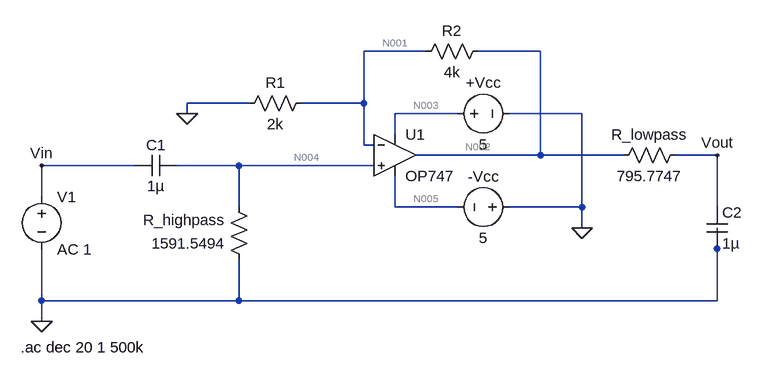
[diagram p0: schematic RC_Active Bandpass Filter.asc]
RC_Active Bandpass Filter.asc, the LTspice schematic file:
Version 4
SHEET 1 968 680
WIRE 432 -64 336 -64
WIRE 608 -64 512 -64
WIRE 160 16 64 16
WIRE 336 16 336 -64
WIRE 336 16 240 16
WIRE 64 32 64 16
WIRE 480 32 384 32
WIRE 672 32 560 32
WIRE 384 64 384 32
WIRE 336 80 336 16
WIRE 352 80 336 80
WIRE 608 96 608 -64
WIRE 608 96 416 96
WIRE 736 96 608 96
WIRE 880 96 816 96
WIRE -16 112 -160 112
WIRE 144 112 48 112
WIRE 352 112 144 112
WIRE -160 160 -160 112
WIRE 144 176 144 112
WIRE 384 176 384 128
WIRE 480 176 384 176
WIRE 672 176 672 32
WIRE 672 176 560 176
WIRE 880 176 880 96
WIRE 672 208 672 176
WIRE 880 240 880 208
WIRE -160 320 -160 240
WIRE 144 320 144 256
WIRE 144 320 -160 320
WIRE 880 320 880 240
WIRE 880 320 144 320
WIRE -160 352 -160 320
FLAG 64 32 0
FLAG -160 352 0
FLAG -160 112 Vin
FLAG 880 96 Vout
FLAG 672 208 0
SYMBOL cap 48 96 R90
WINDOW 0 0 32 VBottom 2
WINDOW 3 32 32 VTop 2
SYMATTR InstName C1
SYMATTR Value 1µ
SYMBOL res 160 272 R180
WINDOW 0 36 76 Left 2
WINDOW 3 36 40 Left 2
SYMATTR InstName R_highpass
SYMATTR Value 1591.5494
SYMBOL voltage -160 144 R0
WINDOW 123 24 97 Left 2
WINDOW 39 0 0 Left 0
SYMATTR Value2 AC 1
SYMATTR InstName V1
SYMATTR Value ""
SYMBOL OpAmps\\OP747 384 32 R0
SYMATTR InstName U1
SYMBOL res 256 0 R90
WINDOW 0 0 56 VBottom 2
WINDOW 3 32 56 VTop 2
SYMATTR InstName R1
SYMATTR Value 2k
SYMBOL res 528 -80 R90
WINDOW 0 0 56 VBottom 2
WINDOW 3 32 56 VTop 2
SYMATTR InstName R2
SYMATTR Value 4k
SYMBOL voltage 464 32 R270
WINDOW 0 32 56 VTop 2
WINDOW 3 -32 56 VBottom 2
WINDOW 123 0 0 Left 0
WINDOW 39 0 0 Left 0
SYMATTR InstName +Vcc
SYMATTR Value 5
SYMBOL voltage 576 176 R90
WINDOW 0 -32 56 VBottom 2
WINDOW 3 32 56 VTop 2
WINDOW 123 0 0 Left 0
WINDOW 39 0 0 Left 0
SYMATTR InstName -Vcc
SYMATTR Value 5
SYMBOL res 832 80 R90
WINDOW 0 0 56 VBottom 2
WINDOW 3 32 56 VTop 2
SYMATTR InstName R_lowpass
SYMATTR Value 795.7747
SYMBOL cap 864 176 R0
SYMATTR InstName C2
SYMATTR Value 1µ
TEXT -192 392 Left 2 !.ac dec 20 1 500k

The netlist it stands for:
* RC_Active Bandpass Filter.asc
C1 N004 Vin 1µ
R_highpass 0 N004 1591.5494
V1 Vin 0 AC 1
XU1 N004 N001 N003 N005 N002 OP747  ; pins In+ In- V+ V- OUT
R1 N001 0 2k
R2 N002 N001 4k
V§+Vcc N003 0 5
V§-Vcc 0 N005 5
R_lowpass Vout N002 795.7747
C2 Vout 0 1µ
.ac dec 20 1 500k
.backanno
.end

* Results of the author's LTspice run, read from the files saved beside the schematic
* Operating Point, zero values left out:
*   V(n004) = 18.46 µV
*   V(n001) = 98.46 µV
*   V(n005) = -5 V
*   V(n003) = 5 V
*   V(n002) = 257 µV
*   V(vout) = 257 µV
*   I(R2) = 39.63 nA
*   I(R1) = 49.23 nA
*   I(R_highpass) = -11.6 nA
*   I(-vcc) = -233.8 µA
*   I(+vcc) = -233.9 µA
*   Ix(u1:1) = -11.6 nA
*   Ix(u1:2) = -9.598 nA
*   Ix(u1:99) = 233.9 µA
*   Ix(u1:50) = -233.8 µA
*   Ix(u1:45) = -39.63 nA
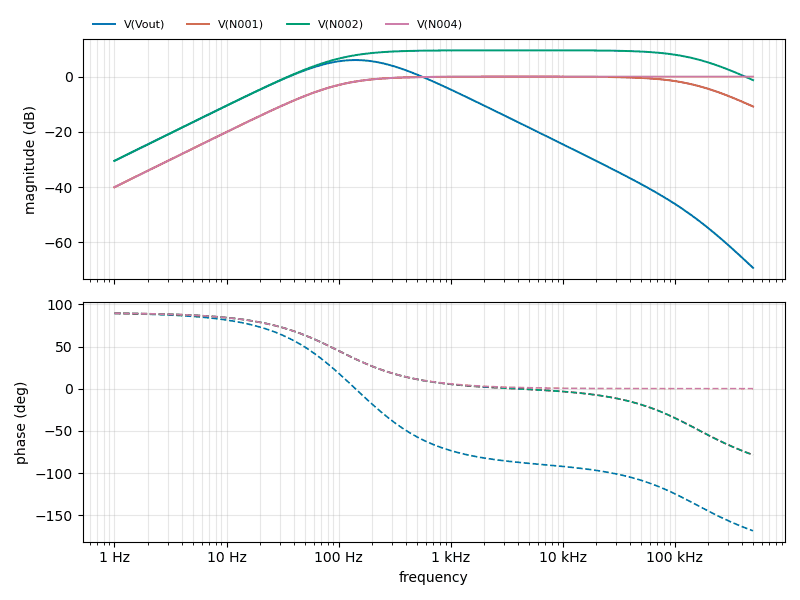
[diagram p1: AC Analysis of RC_Active Bandpass Filter.asc, plotted from the saved traces]
* AC Analysis, 1 run:
*   V(Vout): -30.46 dB at 1 Hz, -69.21 dB at 500 kHz, peak 6.02 dB at 141.3 Hz, 3 dB below the peak at 56.17 Hz and 356.2 Hz
*   V(N001): -40.00 dB at 1 Hz, -10.80 dB at 500 kHz, peak -0.00 dB at 3.981 kHz, 3 dB below the peak at 99.94 Hz and 150.3 kHz
*   V(N002): -30.46 dB at 1 Hz, -1.26 dB at 500 kHz, peak 9.54 dB at 3.981 kHz, 3 dB below the peak at 99.94 Hz and 150.3 kHz
*   V(N004): -40.00 dB at 1 Hz, -0.00 dB at 500 kHz, peak -0.00 dB at 500 kHz, 3 dB below the peak at 100 Hz